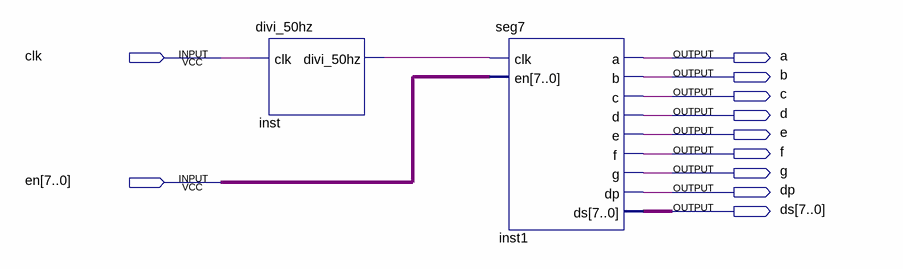
[diagram p0: schematic sheet]
// Quartus schematic state7.bdf as structural Verilog: 2 symbols, 11 pins
module state7 (
  input  clk,
  input  [7:0] en,
  output a,
  output b,
  output c,
  output d,
  output e,
  output f,
  output g,
  output dp,
  output [7:0] ds
);

  wire inst_divi_50hz;

  divi_50hz inst (.clk(clk), .divi_50hz(inst_divi_50hz));
  seg7 inst1 (.clk(inst_divi_50hz), .en(en), .a(a), .b(b), .c(c), .d(d), .e(e), .f(f), .g(g), .dp(dp), .ds(ds));
endmodule
